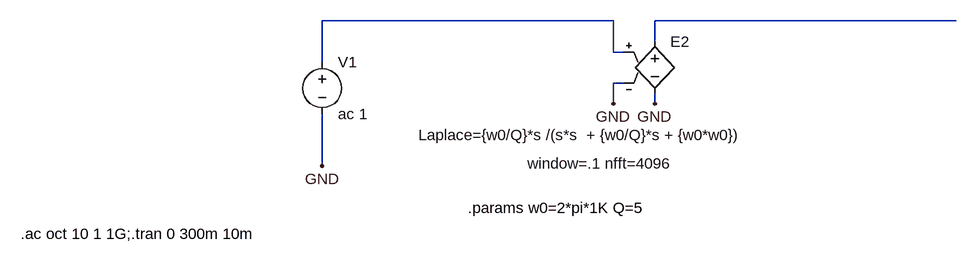
[diagram p0: schematic hum.asc]
hum.asc, the LTspice schematic file:
Version 4
SHEET 1 900 1256
WIRE 432 912 896 912
WIRE 368 1008 368 1040
WIRE 432 1040 432 1024
WIRE 432 944 432 912
WIRE 368 912 368 960
WIRE 368 960 384 960
WIRE 384 1008 368 1008
WIRE -80 1136 -80 1056
WIRE -80 976 -80 912
WIRE -80 912 368 912
FLAG 368 1040 GND
FLAG 432 1040 GND
FLAG -80 1136 GND
SYMBOL voltage -80 960 R0
SYMATTR InstName V1
SYMATTR Value ac 1
SYMBOL e 432 928 R0
WINDOW 3 -364 160 Left 0
WINDOW 39 -196 204 Left 0
SYMATTR InstName E2
SYMATTR Value Laplace={w0/Q}*s /(s*s  + {w0/Q}*s + {w0*w0})
SYMATTR SpiceLine window=.1 nfft=4096
TEXT -544 1240 Left 0 !.ac oct 10 1 1G;.tran 0 300m 10m
TEXT 144 1200 Left 0 !.params w0=2*pi*1K Q=5

The netlist it stands for:
* hum.asc
V1 N002 GND ac 1
E2 N001 GND N002 GND Laplace={w0/Q}*s /(s*s  + {w0/Q}*s + {w0*w0}) window=.1 nfft=4096
.ac oct 10 1 1G;.tran 0 300m 10m
.params w0=2*pi*1K Q=5
.backanno
.end